# Altium project WOX.PrjPcb
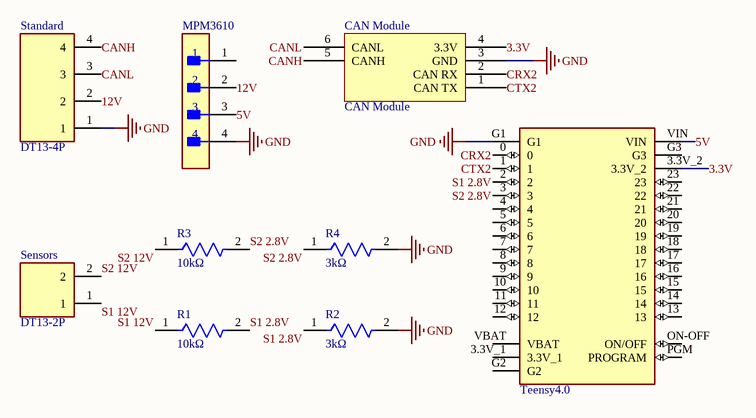
[diagram p0: WOX.SchDoc]
1 sheet, 9 parts. Net scope: global (net labels, ports and power ports of the same name join across sheets).
Board file: WOX.PcbDoc

## Sheet WOX.SchDoc
size A3; SheetNumber: 1; SheetTotal: 1

### Parts
CAN_Module  CAN Module  [CAN Module-Footprint-1]
MPM3610  B04B-XASK-1(LF)(SN)  [FP-B04B-XASK-1_LF_SN-MFG]  (value not drawn)
R1  10kΩ  [FP-RLR07-MFG]
R2  3kΩ  [FP-RNC65-MFG]
R3  10kΩ  [FP-RLR07-MFG]
R4  3kΩ  [FP-RNC65-MFG]
Sensors  DT13-2P  [TE_DT13-2P]
Standard  DT13-4P  [TE_DT13-4P]
Teensy4.0  DEV-15583  [MODULE_DEV-15583]  (value not drawn)

### Nets
GND: CAN_Module.3(GND) MPM3610.4 R2.2 R4.2 Standard.1 Teensy4.0.G1
3.3V: CAN_Module.4(3.3V) Teensy4.0.3.3V_2
5V: MPM3610.3 Teensy4.0.VIN
12V: MPM3610.2 Standard.2
CANH: CAN_Module.5(CANH) Standard.4
CANL: CAN_Module.6(CANL) Standard.3
CRX2: CAN_Module.2(CAN_RX) Teensy4.0.0
CTX2: CAN_Module.1(CAN_TX) Teensy4.0.1
S1 2.8V: R1.2 R2.1 Teensy4.0.2
S1 12V: R1.1 Sensors.1
S2 2.8V: R3.2 R4.1 Teensy4.0.3
S2 12V: R3.1 Sensors.2

Not connected (* = marked no-connect by the designer): MPM3610 1; Teensy4.0 3.3V_1 4 5 6 7 8 9 10 11 12 13 14 15 16 17 18 19 20 21 22 23 G2 G3 ON-OFF(ON/OFF) PGM(PROGRAM) VBAT

### Library data of the parts
CAN_Module = CMP-00030-00003-1: CAN waveshare
MPM3610 = CMP-17439-000018-1: CONN HEADER VERT 4POS 2.5MM; Manufacturer: JST; Current Rating: 3A; Voltage Rating: 250V; Conn Orientation: Straight; Conn Gender: Male; Number Of Contacts: 4; ComponentLink2Description: Datasheet; Package: B04B-XASK-1(LF)(SN); Octopart: https://octopart.com/b04b-xask-1%28lf%29%28sn%29-jst-3990149; Pitch: 2.5mm; Device Class L1: Connectors; RoHS: TRUE; Device Class L3: unset; Manufacturer Part Number: B04B-XASK-1(LF)(SN); Temperature Range High: +85°C; Height: 8.8mm; Lead Free: Yes; Category: Conn; Temperature: -25°C to +85°C; Digikey Description: CONN HEADER VERT 4POS 2.5MM; Temperature Range Low: -25°C; ComponentLink2URL: http://www.jst-mfg.com/product/pdf/eng/eXA1.pdf; Contact Material: Tin,Copper; Device Class L2: Headers and Wire Housings; Automotive: No; Number Of Rows: 1
R1 R3 = CMP-00030-39449004-1: RLR07C1002FSB14 Fixed Resistor, Metal Film, 0.25W, 10000ohm, 250V, 1% +/-Tol, 100ppm/Cel, Through Hole Mount; Power Rating: 250mW; Lead Diameter: 640µm; Wire/Cable Diameter: 50.8µm; Lead Length: 38.1mm; Temperature Coefficient: 100ppm/°C; Military Standard: MIL-PRF-39017; Max Operating Temperature: 150°C; Width: 2.29mm; Mount: Through Hole; Composition: Metal Film; REACH SVHC: Unknown; Tolerance: 1%; Failure Rate: 0.001%; Min Operating Temperature: -65°C; Voltage Rating: 250V; Schedule B: 8533210090, 8533210090; Max Power Dissipation: 250mW; Length: 7.62mm; Case/Package: Conformal; Lead Free: Contains Lead; NexarPartId: 39449004; Radiation Hardening: No; Resistance: 10kΩ; Termination: Axial; Number of Pins: 14; RoHS: Non-Compliant; Packaging: Bulk; Features: Military, Moisture Resistant, Weldable; Number of Terminations: 2; Contact Plating: Lead, Tin; Diameter: 2.29mm; Voltage Rating (DC): 250V
R2 R4 = CMP-02408-000008-1: Res Metal Film 3.01K Ohm 1% 0.5W(1/2W) ±50ppm/C 0.01% Epoxy AXL T/R; Manufacturer Part Number: RNC65H3011FRB14; Manufacturer: Vishay; Resistance: 3.01kΩ; Voltage Rating: 300V; Value: 3.01kΩ; Temperature Coefficient: 50ppm/°C; Device Class L3: Through-Hole Resistors; Temperature Range High: +175°C; Tolerance: 1%; Military Standard: true; Device Class L2: Resistors; Temperature: -65°C to +175°C; Lead Free: Yes; Category: Res; RoHS: TRUE; Series: RNC; Temperature Range Low: -65°C; Package: RNC65; Octopart: https://octopart.com/rnc65h3011frb14-vishay-40281131; ComponentLink2Description: Datasheet; Composition: Metal Film; Device Class L1: Passive Components; Height: 4.95mm; Ipc Land Pattern Name: RESAD2083W85L1745D495; Automotive: No; ComponentLink2URL: https://www.vishay.com/docs/31025/erc.pdf; Power Rating: 0.5W
Sensors = DT13-2P: DT13 Series, 5.46mm Pitch 2 Way 1 Row Right Angle PCB Header, Solder Termination; MF: TE Connectivity; Value: *; Price: None; Package: None; Availability: Unavailable; SnapEDA_Link: https://www.snapeda.com/parts/DT13-2P/TE%20Connectivity%20Deutsch%20Connectors/view-part/1788306/?ref=snap; EU_RoHS_Compliance: Compliant; DigiKey-Purchase-URL: https://snapeda.com/shop?store=DigiKey&id=1788306; MP: DT13-2P
Standard = DT13-4P: DT13 Series, 4.44mm Pitch 4 Way 2 Row Right Angle PCB Header, Solder Termination; MF: TE Connectivity; SnapEDA_Link: https://www.snapeda.com/parts/DT13-4P/TE%20Connectivity%20Deutsch%20Connectors/view-part/2708791/?ref=snap; MP: DT13-4P; TE_purchase_URL: https://www.te.com/usa-en/product-DT13-4P.html?te_bu=Cor&te_type=disp&te_campaign=seda_glo_cor-seda-global-disp-prtnr-fy19-seda-model-bom-cta_sma-317_1&elqCampaignId=32493; Availability: Unavailable; Value: *; Price: None; Package: None
Teensy4.0 = DEV-15583: RT1062 Teensy 4.0 i.MX ARMÂ® CortexÂ®-M7 MPU Embedded Evaluation Board; MF: SparkFun Electronics; Value: *; Package: None; Digi-Key_Part_Number: 1568-DEV-15583-ND; Digi-Key_Purchase_URL: https://www.digikey.com/product-detail/en/sparkfun-electronics/DEV-15583/1568-DEV-15583-ND/10384551?utm_source=snapeda&utm_medium=aggregator&utm_campaign=symbol; MP: DEV-15583; SnapEDA_Link: https://www.snapeda.com/parts/DEV-15583/SparkFun%20Electronics/view-part/4001229/?ref=snap